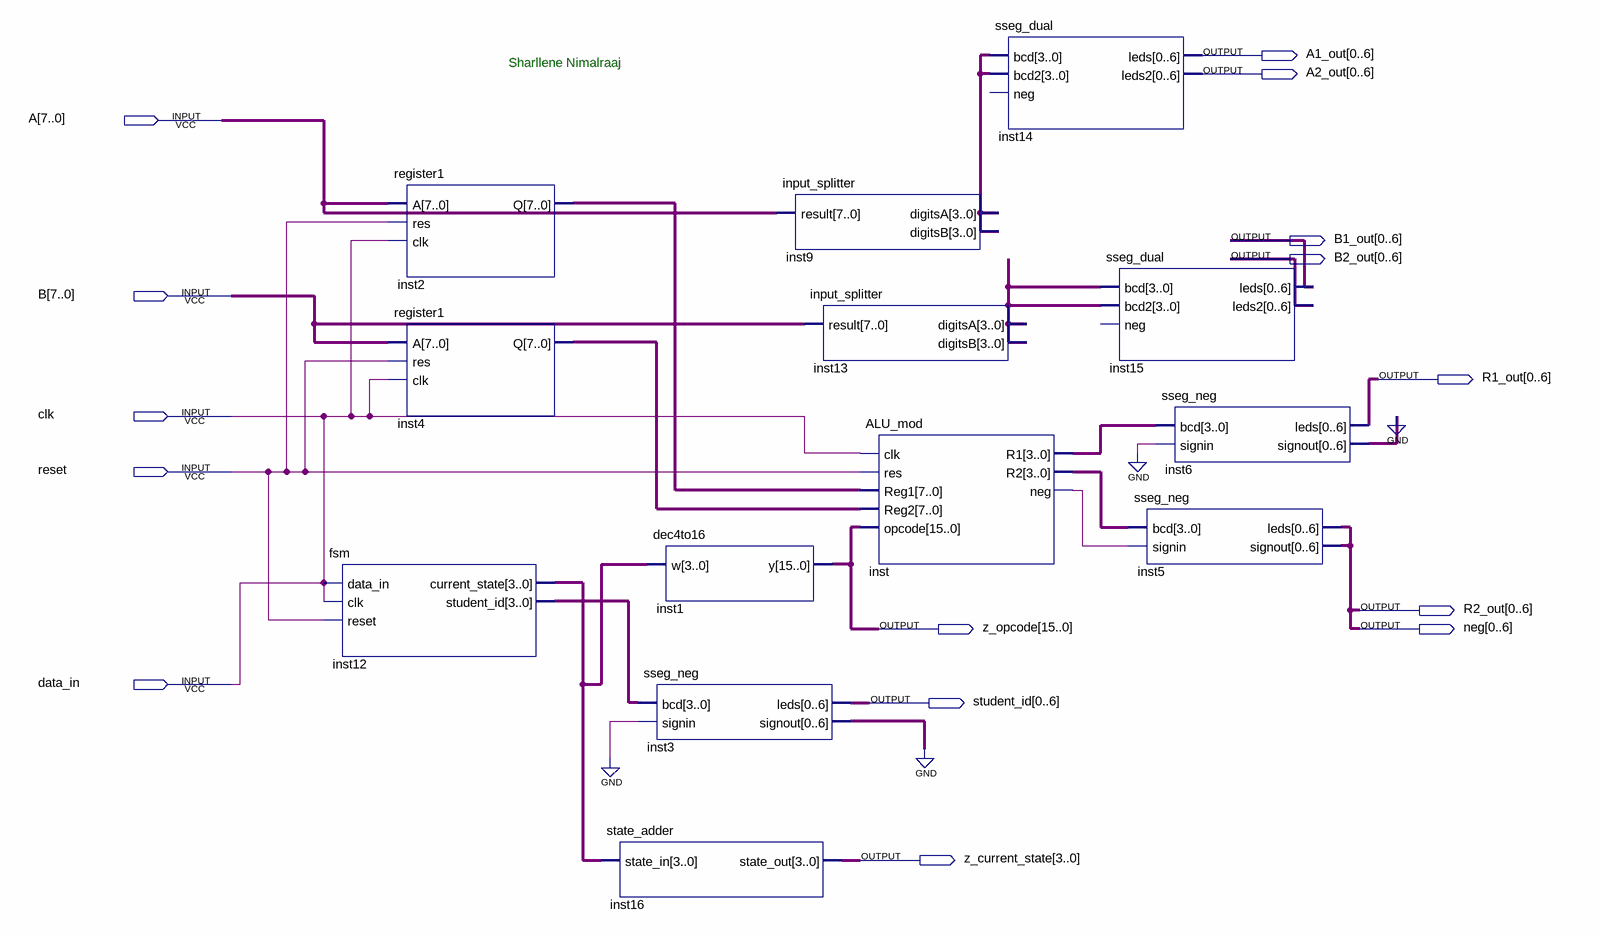
[diagram p0: schematic sheet]
// Quartus schematic CPUp2.bdf as structural Verilog: 13 symbols, 15 pins
module CPUp2 (
  input  [7:0] A,
  input  [7:0] B,
  input  clk,
  input  reset,
  input  data_in,
  output [0:6] A1_out,
  output [0:6] A2_out,
  output [0:6] B1_out,
  output [0:6] B2_out,
  output [0:6] R1_out,
  output [0:6] R2_out,
  output [15:0] z_opcode,
  output [0:6] neg,
  output [0:6] student_id,
  output [3:0] z_current_state
);

  wire inst_neg;
  wire [3:0] inst9_digitsa, inst12_current_state, inst12_student_id, inst13_digitsa, inst_r1, inst_r2;
  wire [6:0] inst3_signout, inst6_signout;
  wire [7:0] inst2_q, inst4_q;

  fsm inst12 (
    .data_in(clk), .clk(clk), .reset(reset), .current_state(inst12_current_state),
    .student_id(inst12_student_id));
  register1 inst2 (.A(A), .res(reset), .clk(clk), .Q(inst2_q));
  register1 inst4 (.A(B), .res(reset), .clk(clk), .Q(inst4_q));
  dec4to16 inst1 (.w(inst12_current_state), .y(z_opcode));
  sseg_neg inst3 (.bcd(inst12_student_id), .signin(1'b0), .leds(student_id), .signout(inst3_signout));
  state_adder inst16 (.state_in(inst12_current_state), .state_out(z_current_state));
  input_splitter inst9 (.result(A), .digitsA(inst9_digitsa), .digitsB(inst9_digitsa));
  input_splitter inst13 (.result(B), .digitsA(inst13_digitsa), .digitsB(inst13_digitsa));
  ALU_mod inst (
    .clk(clk), .res(reset), .Reg1(inst2_q), .Reg2(inst4_q), .opcode(z_opcode), .R1(inst_r1), .R2(inst_r2),
    .neg(inst_neg));
  sseg_dual inst14 (.bcd(inst9_digitsa), .bcd2(inst9_digitsa), .leds(A1_out), .leds2(A2_out));  // open: neg
  sseg_dual inst15 (.bcd(inst13_digitsa), .bcd2(inst13_digitsa), .leds(B1_out), .leds2(B2_out));  // open: neg
  sseg_neg inst6 (.bcd(inst_r1), .signin(1'b0), .leds(R1_out), .signout(inst6_signout));
  sseg_neg inst5 (.bcd(inst_r2), .signin(inst_neg), .leds(neg), .signout(neg));

  assign data_in = clk;
  assign R2_out = neg;
  // also tied to GND on the sheet: {inst3_signout[0], inst3_signout[1], inst3_signout[2], inst3_signout[3], inst3_signout[4], inst3_signout[5], inst3_signout[6], inst6_signout[0], inst6_signout[1], inst6_signout[2], inst6_signout[3], inst6_signout[4], inst6_signout[5], inst6_signout[6]}

  // Notes on the sheet:
  //   Sharllene Nimalraaj
endmodule
